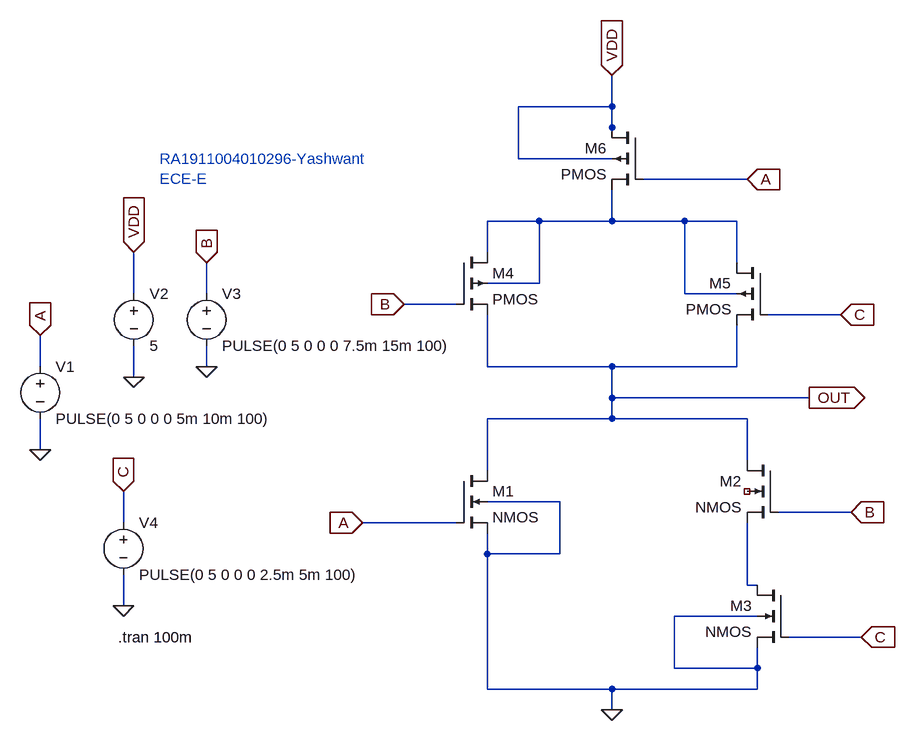
[diagram p0: schematic expt_10a.asc]
expt_10a.asc, the LTspice schematic file:
Version 4
SHEET 1 880 984
WIRE 48 -144 48 -192
WIRE 48 -144 -96 -144
WIRE 48 -112 48 -144
WIRE 48 -96 48 -112
WIRE -96 -64 -96 -144
WIRE 48 -64 -96 -64
WIRE 256 -32 96 -32
WIRE -64 32 -144 32
WIRE 48 32 48 -16
WIRE 48 32 -64 32
WIRE 160 32 48 32
WIRE 240 32 160 32
WIRE -144 80 -144 32
WIRE 240 96 240 32
WIRE -64 128 -64 32
WIRE -64 128 -144 128
WIRE -688 144 -688 80
WIRE -576 144 -576 96
WIRE 160 144 160 32
WIRE 240 144 160 144
WIRE -192 160 -272 160
WIRE 400 176 288 176
WIRE -832 256 -832 208
WIRE -576 256 -576 224
WIRE -144 256 -144 176
WIRE 48 256 -144 256
WIRE 240 256 240 192
WIRE 240 256 48 256
WIRE -688 272 -688 224
WIRE 48 304 48 256
WIRE 352 304 48 304
WIRE 48 336 48 304
WIRE 48 336 -144 336
WIRE 256 336 48 336
WIRE -832 384 -832 336
WIRE 256 400 256 336
WIRE -144 416 -144 336
WIRE -32 464 -144 464
WIRE 416 480 304 480
WIRE -704 496 -704 448
WIRE -192 496 -336 496
WIRE -144 544 -144 512
WIRE -32 544 -32 464
WIRE -32 544 -144 544
WIRE 256 592 256 496
WIRE 272 592 256 592
WIRE -704 624 -704 576
WIRE 272 640 144 640
WIRE 432 672 320 672
WIRE 144 720 144 640
WIRE 272 720 272 688
WIRE 272 720 144 720
WIRE -144 752 -144 544
WIRE 48 752 -144 752
WIRE 272 752 272 720
WIRE 272 752 48 752
WIRE 48 784 48 752
FLAG 48 784 0
FLAG 48 -192 VDD
IOPIN 48 -192 In
FLAG -832 208 A
IOPIN -832 208 In
FLAG 256 -32 A
IOPIN 256 -32 In
FLAG -336 496 A
IOPIN -336 496 In
FLAG -576 96 B
IOPIN -576 96 In
FLAG -272 160 B
IOPIN -272 160 In
FLAG 416 480 B
IOPIN 416 480 In
FLAG -704 448 C
IOPIN -704 448 In
FLAG 400 176 C
IOPIN 400 176 In
FLAG 432 672 C
IOPIN 432 672 In
FLAG 352 304 OUT
IOPIN 352 304 Out
FLAG -688 80 VDD
IOPIN -688 80 In
FLAG -688 272 0
FLAG -832 384 0
FLAG -576 256 0
FLAG -704 624 0
SYMBOL nmos4 -192 416 R0
SYMATTR InstName M1
SYMBOL nmos4 304 400 M0
SYMATTR InstName M2
SYMBOL nmos4 320 592 M0
SYMATTR InstName M3
SYMBOL pmos4 -192 80 R0
SYMATTR InstName M4
SYMBOL pmos4 288 96 M0
SYMATTR InstName M5
SYMBOL pmos4 96 -112 M0
SYMATTR InstName M6
SYMBOL voltage -832 240 R0
WINDOW 123 0 0 Left 0
WINDOW 39 0 0 Left 0
SYMATTR InstName V1
SYMATTR Value PULSE(0 5 0 0 0 5m 10m 100)
SYMBOL voltage -688 128 R0
SYMATTR InstName V2
SYMATTR Value 5
SYMBOL voltage -576 128 R0
WINDOW 123 0 0 Left 0
WINDOW 39 0 0 Left 0
SYMATTR InstName V3
SYMATTR Value PULSE(0 5 0 0 0 7.5m 15m 100)
SYMBOL voltage -704 480 R0
WINDOW 123 0 0 Left 0
WINDOW 39 0 0 Left 0
SYMATTR InstName V4
SYMATTR Value PULSE(0 5 0 0 0 2.5m 5m 100)
TEXT -712 672 Left 2 !.tran 100m
TEXT -648 -64 Left 2 ;RA1911004010296-Yashwant\nECE-E

The netlist it stands for:
* expt_10a.asc
M1 OUT A 0 0 NMOS
M2 OUT B N002 NC_01 NMOS
M3 N002 C 0 0 NMOS
M4 N001 B OUT N001 PMOS
M5 N001 C OUT N001 PMOS
M6 VDD A N001 VDD PMOS
V1 A 0 PULSE(0 5 0 0 0 5m 10m 100)
V2 VDD 0 5
V3 B 0 PULSE(0 5 0 0 0 7.5m 15m 100)
V4 C 0 PULSE(0 5 0 0 0 2.5m 5m 100)
.model NMOS NMOS
.model PMOS PMOS
.lib standard.mos
.tran 100m
* RA1911004010296-Yashwant
* ECE-E
.backanno
.end